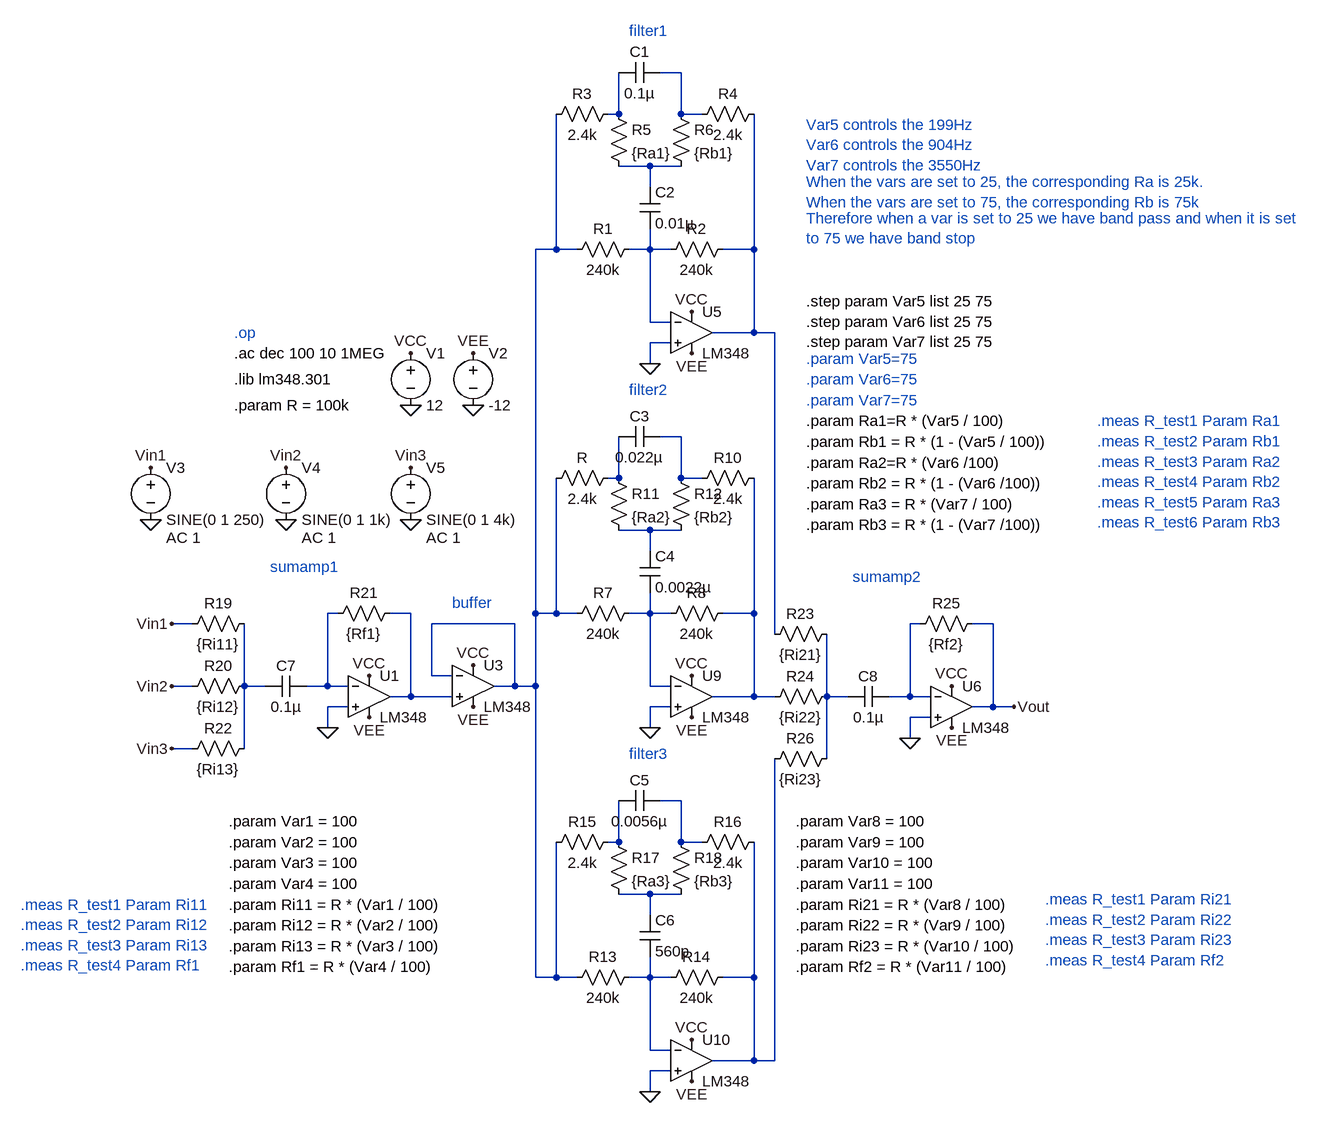
[diagram p0: schematic Equalizer.asc]
Equalizer.asc, the LTspice schematic file:
Version 4
SHEET 1 1768 2448
WIRE 736 784 704 784
WIRE 640 848 640 784
WIRE 640 848 624 848
WIRE 736 848 736 784
WIRE 768 848 736 848
WIRE 688 928 640 928
WIRE 736 928 688 928
WIRE 688 960 688 928
WIRE 544 1056 544 848
WIRE 544 1056 512 1056
WIRE 576 1056 544 1056
WIRE 688 1056 688 1024
WIRE 688 1056 656 1056
WIRE 720 1056 688 1056
WIRE 848 1056 848 848
WIRE 848 1056 800 1056
WIRE 688 1168 688 1056
WIRE 720 1168 688 1168
WIRE 848 1184 848 1056
WIRE 848 1184 784 1184
WIRE 880 1184 848 1184
WIRE 720 1200 688 1200
WIRE 688 1232 688 1200
WIRE 736 1344 704 1344
WIRE 640 1408 640 1344
WIRE 640 1408 624 1408
WIRE 736 1408 736 1344
WIRE 768 1408 736 1408
WIRE 688 1488 640 1488
WIRE 736 1488 688 1488
WIRE 688 1520 688 1488
WIRE 208 1616 192 1616
WIRE 320 1616 288 1616
WIRE 512 1616 512 1056
WIRE 544 1616 544 1408
WIRE 544 1616 512 1616
WIRE 576 1616 544 1616
WIRE 688 1616 688 1584
WIRE 688 1616 656 1616
WIRE 720 1616 688 1616
WIRE 848 1616 848 1408
WIRE 848 1616 800 1616
WIRE -16 1632 -48 1632
WIRE 480 1632 352 1632
WIRE 1104 1632 1088 1632
WIRE 1216 1632 1184 1632
WIRE 880 1648 880 1184
WIRE 352 1712 352 1632
WIRE 384 1712 352 1712
WIRE -16 1728 -48 1728
WIRE 64 1728 64 1632
WIRE 96 1728 64 1728
WIRE 192 1728 192 1616
WIRE 192 1728 160 1728
WIRE 224 1728 192 1728
WIRE 480 1728 480 1632
WIRE 480 1728 448 1728
WIRE 512 1728 512 1616
WIRE 512 1728 480 1728
WIRE 688 1728 688 1616
WIRE 720 1728 688 1728
WIRE 320 1744 320 1616
WIRE 320 1744 288 1744
WIRE 384 1744 320 1744
WIRE 848 1744 848 1616
WIRE 848 1744 784 1744
WIRE 880 1744 848 1744
WIRE 960 1744 960 1648
WIRE 992 1744 960 1744
WIRE 1088 1744 1088 1632
WIRE 1088 1744 1056 1744
WIRE 1120 1744 1088 1744
WIRE 224 1760 192 1760
WIRE 720 1760 688 1760
WIRE 1216 1760 1216 1632
WIRE 1216 1760 1184 1760
WIRE 1248 1760 1216 1760
WIRE 1120 1776 1088 1776
WIRE 192 1792 192 1760
WIRE 688 1792 688 1760
WIRE 1088 1808 1088 1776
WIRE -16 1824 -48 1824
WIRE 64 1824 64 1728
WIRE 960 1840 960 1744
WIRE 736 1904 704 1904
WIRE 640 1968 640 1904
WIRE 640 1968 624 1968
WIRE 736 1968 736 1904
WIRE 768 1968 736 1968
WIRE 688 2048 640 2048
WIRE 736 2048 688 2048
WIRE 688 2080 688 2048
WIRE 512 2176 512 1728
WIRE 544 2176 544 1968
WIRE 544 2176 512 2176
WIRE 576 2176 544 2176
WIRE 688 2176 688 2144
WIRE 688 2176 656 2176
WIRE 720 2176 688 2176
WIRE 848 2176 848 1968
WIRE 848 2176 800 2176
WIRE 688 2288 688 2176
WIRE 720 2288 688 2288
WIRE 848 2304 848 2176
WIRE 848 2304 784 2304
WIRE 880 2304 880 1840
WIRE 880 2304 848 2304
WIRE 720 2320 688 2320
WIRE 688 2352 688 2320
FLAG 320 1296 0
FLAG 416 1296 0
FLAG 320 1216 VCC
FLAG 416 1216 VEE
FLAG -80 1472 0
FLAG 128 1472 0
FLAG 320 1472 0
FLAG -80 1392 Vin1
FLAG 128 1392 Vin2
FLAG 320 1392 Vin3
FLAG 752 1152 VCC
FLAG 416 1696 VCC
FLAG 256 1712 VCC
FLAG 416 1760 VEE
FLAG 256 1776 VEE
FLAG 752 1216 VEE
FLAG 688 1232 0
FLAG 752 1712 VCC
FLAG 752 1776 VEE
FLAG 688 1792 0
FLAG 752 2272 VCC
FLAG 752 2336 VEE
FLAG 688 2352 0
FLAG 192 1792 0
FLAG 1152 1728 VCC
FLAG 1152 1792 VEE
FLAG 1088 1808 0
FLAG -48 1728 Vin2
FLAG -48 1824 Vin3
FLAG 1248 1760 Vout
FLAG -48 1632 Vin1
SYMBOL OpAmps\\opamp2 256 1680 R0
SYMATTR InstName U1
SYMATTR Value LM348
SYMBOL OpAmps\\opamp2 416 1664 R0
SYMATTR InstName U3
SYMATTR Value LM348
SYMBOL OpAmps\\opamp2 752 1120 R0
SYMATTR InstName U5
SYMATTR Value LM348
SYMBOL voltage 320 1200 R0
WINDOW 123 0 0 Left 0
WINDOW 39 0 0 Left 0
SYMATTR InstName V1
SYMATTR Value 12
SYMBOL voltage 416 1200 R0
WINDOW 123 0 0 Left 0
WINDOW 39 0 0 Left 0
SYMATTR InstName V2
SYMATTR Value -12
SYMBOL voltage -80 1376 R0
WINDOW 123 24 124 Left 2
WINDOW 39 0 0 Left 0
SYMATTR Value2 AC 1
SYMATTR InstName V3
SYMATTR Value SINE(0 1 250)
SYMBOL voltage 128 1376 R0
WINDOW 123 24 124 Left 2
WINDOW 39 0 0 Left 0
SYMATTR Value2 AC 1
SYMATTR InstName V4
SYMATTR Value SINE(0 1 1k)
SYMBOL voltage 320 1376 R0
WINDOW 123 24 124 Left 2
WINDOW 39 0 0 Left 0
SYMATTR Value2 AC 1
SYMATTR InstName V5
SYMATTR Value SINE(0 1 4k)
SYMBOL res 672 1040 R90
WINDOW 0 0 56 VBottom 2
WINDOW 3 32 56 VTop 2
SYMATTR InstName R1
SYMATTR Value 240k
SYMBOL res 816 1040 R90
WINDOW 0 0 56 VBottom 2
WINDOW 3 32 56 VTop 2
SYMATTR InstName R2
SYMATTR Value 240k
SYMBOL res 640 832 R90
WINDOW 0 0 56 VBottom 2
WINDOW 3 32 56 VTop 2
SYMATTR InstName R3
SYMATTR Value 2.4k
SYMBOL res 864 832 R90
WINDOW 0 0 56 VBottom 2
WINDOW 3 32 56 VTop 2
SYMATTR InstName R4
SYMATTR Value 2.4k
SYMBOL res 624 832 R0
SYMATTR InstName R5
SYMATTR Value {Ra1}
SYMBOL res 720 832 R0
SYMATTR InstName R6
SYMATTR Value {Rb1}
SYMBOL cap 704 768 R90
WINDOW 0 0 32 VBottom 2
WINDOW 3 32 32 VTop 2
SYMATTR InstName C1
SYMATTR Value 0.1µ
SYMBOL cap 672 960 R0
SYMATTR InstName C2
SYMATTR Value 0.01µ
SYMBOL OpAmps\\opamp2 752 1680 R0
SYMATTR InstName U9
SYMATTR Value LM348
SYMBOL res 672 1600 R90
WINDOW 0 0 56 VBottom 2
WINDOW 3 32 56 VTop 2
SYMATTR InstName R7
SYMATTR Value 240k
SYMBOL res 816 1600 R90
WINDOW 0 0 56 VBottom 2
WINDOW 3 32 56 VTop 2
SYMATTR InstName R8
SYMATTR Value 240k
SYMBOL res 640 1392 R90
WINDOW 0 0 56 VBottom 2
WINDOW 3 32 56 VTop 2
SYMATTR InstName R
SYMATTR Value 2.4k
SYMBOL res 864 1392 R90
WINDOW 0 0 56 VBottom 2
WINDOW 3 32 56 VTop 2
SYMATTR InstName R10
SYMATTR Value 2.4k
SYMBOL res 624 1392 R0
SYMATTR InstName R11
SYMATTR Value {Ra2}
SYMBOL res 720 1392 R0
SYMATTR InstName R12
SYMATTR Value {Rb2}
SYMBOL cap 704 1328 R90
WINDOW 0 0 32 VBottom 2
WINDOW 3 32 32 VTop 2
SYMATTR InstName C3
SYMATTR Value 0.022µ
SYMBOL cap 672 1520 R0
SYMATTR InstName C4
SYMATTR Value 0.0022µ
SYMBOL OpAmps\\opamp2 752 2240 R0
SYMATTR InstName U10
SYMATTR Value LM348
SYMBOL res 672 2160 R90
WINDOW 0 0 56 VBottom 2
WINDOW 3 32 56 VTop 2
SYMATTR InstName R13
SYMATTR Value 240k
SYMBOL res 816 2160 R90
WINDOW 0 0 56 VBottom 2
WINDOW 3 32 56 VTop 2
SYMATTR InstName R14
SYMATTR Value 240k
SYMBOL res 640 1952 R90
WINDOW 0 0 56 VBottom 2
WINDOW 3 32 56 VTop 2
SYMATTR InstName R15
SYMATTR Value 2.4k
SYMBOL res 864 1952 R90
WINDOW 0 0 56 VBottom 2
WINDOW 3 32 56 VTop 2
SYMATTR InstName R16
SYMATTR Value 2.4k
SYMBOL res 624 1952 R0
SYMATTR InstName R17
SYMATTR Value {Ra3}
SYMBOL res 720 1952 R0
SYMATTR InstName R18
SYMATTR Value {Rb3}
SYMBOL cap 704 1888 R90
WINDOW 0 0 32 VBottom 2
WINDOW 3 32 32 VTop 2
SYMATTR InstName C5
SYMATTR Value 0.0056µ
SYMBOL cap 672 2080 R0
SYMATTR InstName C6
SYMATTR Value 560p
SYMBOL res 80 1616 R90
WINDOW 0 0 56 VBottom 2
WINDOW 3 32 56 VTop 2
SYMATTR InstName R19
SYMATTR Value {Ri11}
SYMBOL res 80 1712 R90
WINDOW 0 0 56 VBottom 2
WINDOW 3 32 56 VTop 2
SYMATTR InstName R20
SYMATTR Value {Ri12}
SYMBOL res 304 1600 R90
WINDOW 0 0 56 VBottom 2
WINDOW 3 32 56 VTop 2
SYMATTR InstName R21
SYMATTR Value {Rf1}
SYMBOL res 80 1808 R90
WINDOW 0 0 56 VBottom 2
WINDOW 3 32 56 VTop 2
SYMATTR InstName R22
SYMATTR Value {Ri13}
SYMBOL cap 160 1712 R90
WINDOW 0 0 32 VBottom 2
WINDOW 3 32 32 VTop 2
SYMATTR InstName C7
SYMATTR Value 0.1µ
SYMBOL OpAmps\\opamp2 1152 1696 R0
SYMATTR InstName U6
SYMATTR Value LM348
SYMBOL res 976 1632 R90
WINDOW 0 0 56 VBottom 2
WINDOW 3 32 56 VTop 2
SYMATTR InstName R23
SYMATTR Value {Ri21}
SYMBOL res 976 1728 R90
WINDOW 0 0 56 VBottom 2
WINDOW 3 32 56 VTop 2
SYMATTR InstName R24
SYMATTR Value {Ri22}
SYMBOL res 1200 1616 R90
WINDOW 0 0 56 VBottom 2
WINDOW 3 32 56 VTop 2
SYMATTR InstName R25
SYMATTR Value {Rf2}
SYMBOL res 976 1824 R90
WINDOW 0 0 56 VBottom 2
WINDOW 3 32 56 VTop 2
SYMATTR InstName R26
SYMATTR Value {Ri23}
SYMBOL cap 1056 1728 R90
WINDOW 0 0 32 VBottom 2
WINDOW 3 32 32 VTop 2
SYMATTR InstName C8
SYMATTR Value 0.1µ
TEXT 104 1544 Left 2 ;sumamp1
TEXT 384 1600 Left 2 ;buffer
TEXT 656 720 Left 2 ;filter1
TEXT 656 1272 Left 2 ;filter2
TEXT 656 1832 Left 2 ;filter3
TEXT 1000 1560 Left 2 ;sumamp2
TEXT 48 1256 Left 2 !.lib lm348.301
TEXT 48 1296 Left 2 !.param R = 100k
TEXT 928 1224 Left 2 ;.param Var5=75
TEXT 928 1256 Left 2 ;.param Var6=75
TEXT 928 1288 Left 2 ;.param Var7=75
TEXT 928 1320 Left 2 !.param Ra1=R * (Var5 / 100)
TEXT 928 1352 Left 2 !.param Rb1 = R * (1 - (Var5 / 100))
TEXT 928 1384 Left 2 !.param Ra2=R * (Var6 /100)
TEXT 928 1416 Left 2 !.param Rb2 = R * (1 - (Var6 /100))
TEXT 928 1448 Left 2 !.param Ra3 = R * (Var7 / 100)
TEXT 928 1480 Left 2 !.param Rb3 = R * (1 - (Var7 /100))
TEXT 40 1936 Left 2 !.param Var1 = 100
TEXT 40 1968 Left 2 !.param Var2 = 100
TEXT 40 2000 Left 2 !.param Var3 = 100
TEXT 40 2032 Left 2 !.param Var4 = 100
TEXT 40 2064 Left 2 !.param Ri11 = R * (Var1 / 100)
TEXT 40 2096 Left 2 !.param Ri12 = R * (Var2 / 100)
TEXT 40 2128 Left 2 !.param Ri13 = R * (Var3 / 100)
TEXT 40 2160 Left 2 !.param Rf1 = R * (Var4 / 100)
TEXT 912 1936 Left 2 !.param Var8 = 100
TEXT 912 1968 Left 2 !.param Var9 = 100
TEXT 912 2000 Left 2 !.param Var10 = 100
TEXT 912 2032 Left 2 !.param Var11 = 100
TEXT 912 2064 Left 2 !.param Ri21 = R * (Var8 / 100)
TEXT 912 2096 Left 2 !.param Ri22 = R * (Var9 / 100)
TEXT 912 2128 Left 2 !.param Ri23 = R * (Var10 / 100)
TEXT 912 2160 Left 2 !.param Rf2 = R * (Var11 / 100)
TEXT 48 1216 Left 2 !.ac dec 100 10 1MEG
TEXT 928 1136 Left 2 !.step param Var5 list 25 75\n.step param Var6 list 25 75\n.step param Var7 list 25 75
TEXT 48 1184 Left 2 ;.op
TEXT 1376 1320 Left 2 ;.meas R_test1 Param Ra1\n.meas R_test2 Param Rb1\n.meas R_test3 Param Ra2\n.meas R_test4 Param Rb2\n.meas R_test5 Param Ra3\n.meas R_test6 Param Rb3
TEXT 1296 2056 Left 2 ;.meas R_test1 Param Ri21\n.meas R_test2 Param Ri22\n.meas R_test3 Param Ri23\n.meas R_test4 Param Rf2
TEXT -280 2064 Left 2 ;.meas R_test1 Param Ri11\n.meas R_test2 Param Ri12\n.meas R_test3 Param Ri13\n.meas R_test4 Param Rf1
TEXT 928 952 Left 2 ;When the vars are set to 25, the corresponding Ra is 25k.\nWhen the vars are set to 75, the corresponding Rb is 75k
TEXT 928 864 Left 2 ;Var5 controls the 199Hz\nVar6 controls the 904Hz\nVar7 controls the 3550Hz
TEXT 928 1008 Left 2 ;Therefore when a var is set to 25 we have band pass and when it is set\nto 75 we have band stop

The netlist it stands for:
* Equalizer.asc
XU1 0 N010 VCC VEE N011 LM348  ; pins In+ In- V+ V- OUT
XU3 N011 N004 VCC VEE N004 LM348  ; pins In+ In- V+ V- OUT
XU5 0 N005 VCC VEE N006 LM348  ; pins In+ In- V+ V- OUT
V1 VCC 0 12
V2 VEE 0 -12
V3 Vin1 0 SINE(0 1 250) AC 1
V4 Vin2 0 SINE(0 1 1k) AC 1
V5 Vin3 0 SINE(0 1 4k) AC 1
R1 N005 N004 240k
R2 N006 N005 240k
R3 N002 N004 2.4k
R4 N006 N001 2.4k
R5 N002 N003 {Ra1}
R6 N001 N003 {Rb1}
C1 N001 N002 0.1µ
C2 N003 N005 0.01µ
XU9 0 N012 VCC VEE N013 LM348  ; pins In+ In- V+ V- OUT
R7 N012 N004 240k
R8 N013 N012 240k
R N008 N004 2.4k
R10 N013 N007 2.4k
R11 N008 N009 {Ra2}
R12 N007 N009 {Rb2}
C3 N007 N008 0.022µ
C4 N009 N012 0.0022µ
XU10 0 N020 VCC VEE N021 LM348  ; pins In+ In- V+ V- OUT
R13 N020 N004 240k
R14 N021 N020 240k
R15 N018 N004 2.4k
R16 N021 N017 2.4k
R17 N018 N019 {Ra3}
R18 N017 N019 {Rb3}
C5 N017 N018 0.0056µ
C6 N019 N020 560p
R19 N015 Vin1 {Ri11}
R20 N015 Vin2 {Ri12}
R21 N011 N010 {Rf1}
R22 N015 Vin3 {Ri13}
C7 N010 N015 0.1µ
XU6 0 N014 VCC VEE Vout LM348  ; pins In+ In- V+ V- OUT
R23 N016 N006 {Ri21}
R24 N016 N013 {Ri22}
R25 Vout N014 {Rf2}
R26 N016 N021 {Ri23}
C8 N014 N016 0.1µ
* sumamp1
* buffer
* filter1
* filter2
* filter3
* sumamp2
.lib lm348.301
.param R = 100k
* .param Var5=75
* .param Var6=75
* .param Var7=75
.param Ra1=R * (Var5 / 100)
.param Rb1 = R * (1 - (Var5 / 100))
.param Ra2=R * (Var6 /100)
.param Rb2 = R * (1 - (Var6 /100))
.param Ra3 = R * (Var7 / 100)
.param Rb3 = R * (1 - (Var7 /100))
.param Var1 = 100
.param Var2 = 100
.param Var3 = 100
.param Var4 = 100
.param Ri11 = R * (Var1 / 100)
.param Ri12 = R * (Var2 / 100)
.param Ri13 = R * (Var3 / 100)
.param Rf1 = R * (Var4 / 100)
.param Var8 = 100
.param Var9 = 100
.param Var10 = 100
.param Var11 = 100
.param Ri21 = R * (Var8 / 100)
.param Ri22 = R * (Var9 / 100)
.param Ri23 = R * (Var10 / 100)
.param Rf2 = R * (Var11 / 100)
.ac dec 100 10 1MEG
.step param Var5 list 25 75
.step param Var6 list 25 75
.step param Var7 list 25 75
* .op
* .meas R_test1 Param Ra1
* .meas R_test2 Param Rb1
* .meas R_test3 Param Ra2
* .meas R_test4 Param Rb2
* .meas R_test5 Param Ra3
* .meas R_test6 Param Rb3
* .meas R_test1 Param Ri21
* .meas R_test2 Param Ri22
* .meas R_test3 Param Ri23
* .meas R_test4 Param Rf2
* .meas R_test1 Param Ri11
* .meas R_test2 Param Ri12
* .meas R_test3 Param Ri13
* .meas R_test4 Param Rf1
* When the vars are set to 25, the corresponding Ra is 25k.
* When the vars are set to 75, the corresponding Rb is 75k
* Var5 controls the 199Hz
* Var6 controls the 904Hz
* Var7 controls the 3550Hz
* Therefore when a var is set to 25 we have band pass and when it is set
* to 75 we have band stop
.backanno
.end